# Altium schematic sheet Filter_Section.SchDoc
size A3; DocumentNumber: 5; SheetNumber: 5; SheetTotal: 6
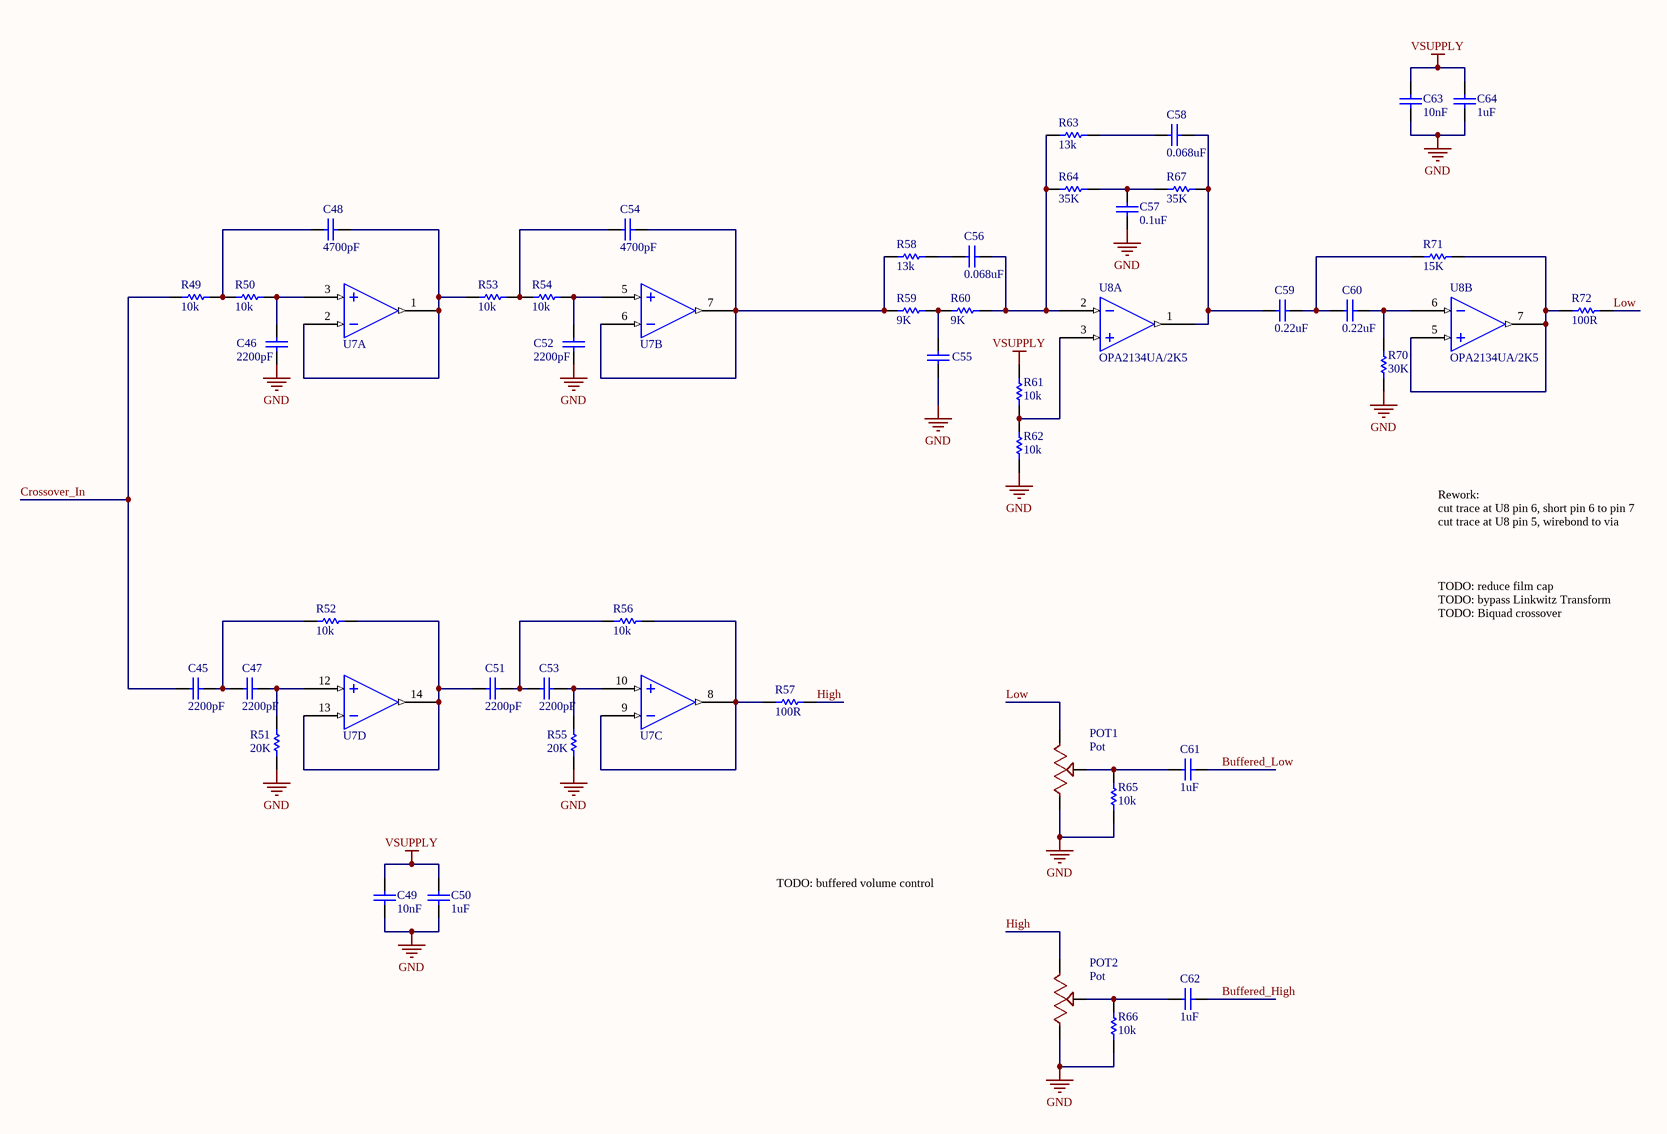
[diagram p0: Filter_Section.SchDoc]

## Parts
C45  2200pF  [CAPC1608X09N]
C46  2200pF  [CAPC1608X09N]
C47  2200pF  [CAPC1608X09N]
C48  4700pF  [CAPC1608X09N]
C49  10nF  [CAPC1608X09N]
C50  1uF  [CAPC1608X09N]
C51  2200pF  [CAPC1608X09N]
C52  2200pF  [CAPC1608X09N]
C53  2200pF  [CAPC1608X09N]
C54  4700pF  [CAPC1608X09N]
C55  0.39uF  [CAP Radial 5mm]  (value not drawn)
C56  0.068uF  [CAPC3216X18N]
C57  0.1uF  [CAPC3216X18N]
C58  0.068uF  [CAPC3216X18N]
C59  0.22uF  [CAP Radial 5mm]
C60  0.22uF  [CAP Radial 5mm]
C61  1uF  [CAP Radial 5mm]
C62  1uF  [CAP Radial 5mm]
C63  10nF  [CAPC1608X09N]
C64  1uF  [CAPC1608X09N]
POT1  Pot  [70543-0002]
POT2  Pot  [70543-0002]
R49  10k  [RESC1608X06N]
R50  10k  [RESC1608X06N]
R51  20K  [RESC1608X06N]
R52  10k  [RESC1608X06N]
R53  10k  [RESC1608X06N]
R54  10k  [RESC1608X06N]
R55  20K  [RESC1608X06N]
R56  10k  [RESC1608X06N]
R57  100R  [RESC1608X06N]
R58  13k  [RESC1608X06N]
R59  9K  [RESC1608X06N]
R60  9K  [RESC1608X06N]
R61  10k  [RESC1608X06N]
R62  10k  [RESC1608X06N]
R63  13k  [RESC1608X06N]
R64  35K  [RESC1608X06N]
R65  10k  [RESC1608X06N]
R66  10k  [RESC1608X06N]
R67  35K  [RESC1608X06N]
R70  30K  [RESC1608X06N]
R71  15K  [RESC1608X06N]
R72  100R  [RESC1608X06N]
U7  OPA4134UA  [SOIC127P600X175-14N]  (value not drawn)  (parts A,B,C,D of 4)
U8  OPA2134UA/2K5  [SOIC127P600X175-8N]  (parts A,B of 2)

## Nets
GND: C46.1 C49.1 C50.1 C52.1 C55.1 C57.2 C63.1 C64.1 POT1.3(B) POT2.3(B) R51.1 R55.2 R62.1 R65.1 R66.1 R70.1 U7.11(V-) U8.4(V-)
VSUPPLY: C49.2 C50.2 C63.2 C64.2 R61.2 U7.4(V+) U8.8(V+)
Buffered_High: C62.2
Buffered_Low: C61.2
Crossover_In: C45.1 R49.1
High: POT2.1(A) R57.2
Low: POT1.1(A) R72.2
NetC45_2: C45.2 C47.1 R52.1
NetC46_2: C46.2 R50.2 U7.3(+In_A)
NetC47_2: C47.2 R51.2 U7.12(+In_D)
NetC48_1: C48.1 R49.2 R50.1
NetC48_2: C48.2 R53.1 U7.1(Out_A) U7.2(-In_A)
NetC51_1: C51.1 R52.2 U7.13(-In_D) U7.14(Out_D)
NetC51_2: C51.2 C53.1 R56.1
NetC52_2: C52.2 R54.2 U7.5(+In_B)
NetC53_2: C53.2 R55.1 U7.10(+In_C)
NetC54_1: C54.1 R53.2 R54.1
NetC54_2: C54.2 R58.1 R59.1 U7.6(-In_B) U7.7(Out_B)
NetC55_2: C55.2 R59.2 R60.1
NetC56_1: C56.1 R58.2
NetC56_2: C56.2 R60.2 R63.1 R64.1 U8.2(-In_A)
NetC57_1: C57.1 R64.2 R67.1
NetC58_1: C58.1 R63.2
NetC58_2: C58.2 C59.1 R67.2 U8.1(Out_A)
NetC59_2: C59.2 C60.1 R71.1
NetC60_2: C60.2 R70.2 U8.6(-In_B)
NetC61_1: C61.1 POT1.2(W) R65.2
NetC62_1: C62.1 POT2.2(W) R66.2
NetR56_2: R56.2 R57.1 U7.8(Out_C) U7.9(-In_C)
NetR61_1: R61.1 R62.2 U8.3(+In_A)
NetR71_2: R71.2 R72.1 U8.5(+In_B) U8.7(Out_B)

## Notes on the sheet
- Rework:
  cut trace at U8 pin 6, short pin 6 to pin 7
  cut trace at U8 pin 5, wirebond to via
- TODO: reduce film cap
- TODO: bypass Linkwitz Transform
- TODO: Biquad crossover
- TODO: buffered volume control

## Library data of the parts
C45-C47 C51-C53 = CAP CER 2200pF 0603: Manufacturer: Murata; Voltage: 50V; Tolerance: 1%; Rating: C0G; Value: 2200pF; Digikey Part Number: 490-7768-1-ND
C48 C54 = CAP CER 4700pF 0603: Manufacturer: TDK; Voltage: 100V; Tolerance: 5%; Rating: C0G; Value: 4700pF; Digikey Part Number: 445-172684-1-ND
C49 C63 = CAP CER 10nF 0603: Bypass caps; Manufacturer: Murata; Value: 10nF; Digikey Part Number: 490-9666-1-ND
C50 C64 = CAP CER 1uF 0603: Voltage: 35V; Value: 1uF; Digikey Part Number: 490-10487-1-ND
C55 = CAP 0.39uF Radial 5mm: Film cap in LT; Manufacturer: EPCOS (TDK); Manufacturer P/N: B32529C105J; Voltage: 63V; Value: 0.39uF; Digikey Part Number: 495-4846-1-ND
C56 C58 = CAP CER 0.068uF 1206: Voltage: 100V; Rating: C0G; Tolerance: 5%; Value: 0.068uF; Digikey Part Number: 445-172693-1-ND; Package: 1206
C57 = CAP CER 0.1uF 1206: LT capacitor; Voltage: 100V; Rating: C0G; Tolerance: 5%; Value: 0.1uF; Digikey Part Number: 445-172694-1-ND; Package: 1206
C59 C60 = CAP 0.22uF Radial 5mm: Film cap in crossover; Manufacturer: EPCOS (TDK); Voltage: 100V; Value: 0.22uF; Digikey Part Number: 495-4985-1-ND
C61 C62 = CAP 1uF Radial 5mm: Audio coupling cap; Manufacturer: EPCOS (TDK); Manufacturer P/N: B32529C105J; Voltage: 63V; Value: 1uF; Digikey Part Number: 495-1119-ND
R49 R50 R52-R54 R56 R61 R62 R65 R66 = RES 10K 0603: Manufacturer: Yageo; Manufacturer Part Number: RC0603FR-0710KL; Tolerance: 1%; Power: 0.1W; Type: RES; Footprint: 0603; Temperature: 155dC; Digikey Part Number: 311-10.0KHRCT-ND; Value: 10k
R51 R55 = RES 20K 0603: Tolerance: 1%; Power: 0.1W; Footprint: 0603; Value: 20K; Digikey Part Number: 311-20.0KHRCT-ND
R57 R72 = RES 100R 0603: Tolerance: 1%; Power: 0.25W; Type: RES; Footprint: 0603; Digikey Part Number: 541-100SACT-ND; Value: 100R
R58 R63 = RES 13K 0603: Tolerance: 1%; Type: RES; Footprint: 0603; Value: 13k; Digikey Part Number: 311-13.0KHRCT-ND
R59 R60 = RES 9K 0603: Tolerance: 1%; Type: RES; Footprint: 0603; Value: 9K; Digikey Part Number: 311-9.09KHRCT-ND
R64 R67 = RES 35K 0603: Tolerance: 1%; Type: RES; Footprint: 0603; Value: 35K; Digikey Part Number: 311-34.8KHRCT-ND
R70 = RES 30K 0603: Tolerance: 1%; Type: RES; Footprint: 0603; Value: 30K; Digikey Part Number: 311-30.0KHRCT-ND
R71 = RES 15K 0603: Tolerance: 1%; Type: RES; Footprint: 0603; Value: 15K; Digikey Part Number: 311-15.0KHRCT-ND
U7 = OPA4134UA: Quad OPAx134 Operational Amplifier; Digikey Part Number: 296-26284-1-ND
U8 = OPA2134UA/2K5: Digikey Part Number: 296-22024-1-ND